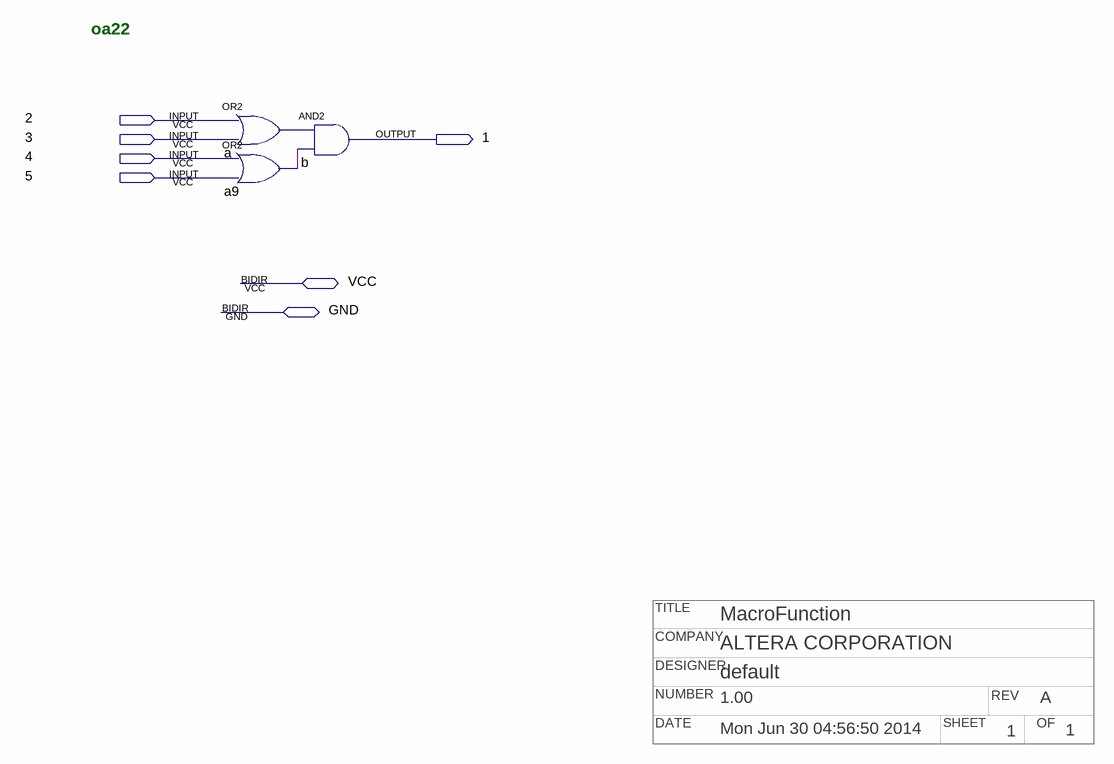
[diagram p0: schematic sheet]
// Quartus schematic npoa22.bdf as structural Verilog: 3 symbols, 7 pins
// Title block: TITLE: MacroFunction; COMPANY: ALTERA CORPORATION; DESIGNER: default; NUMBER: 1.00; REV: A; DATE: Mon Jun 30 04:56:50 2014; SHEET: 1; OF: 1
module npoa22 (
  input  \2 ,
  input  \3 ,
  input  \4 ,
  input  \5 ,
  inout  VCC,
  inout  GND,
  output \1 
);

  wire a9_out, a_out;

  or a (a_out, \2 , \3 );
  or a9 (a9_out, \4 , \5 );
  and b (\1 , a_out, a9_out);

  // Notes on the sheet:
  //   oa22
endmodule
